# EAGLE schematic converter (EAGLE 7.3.2)
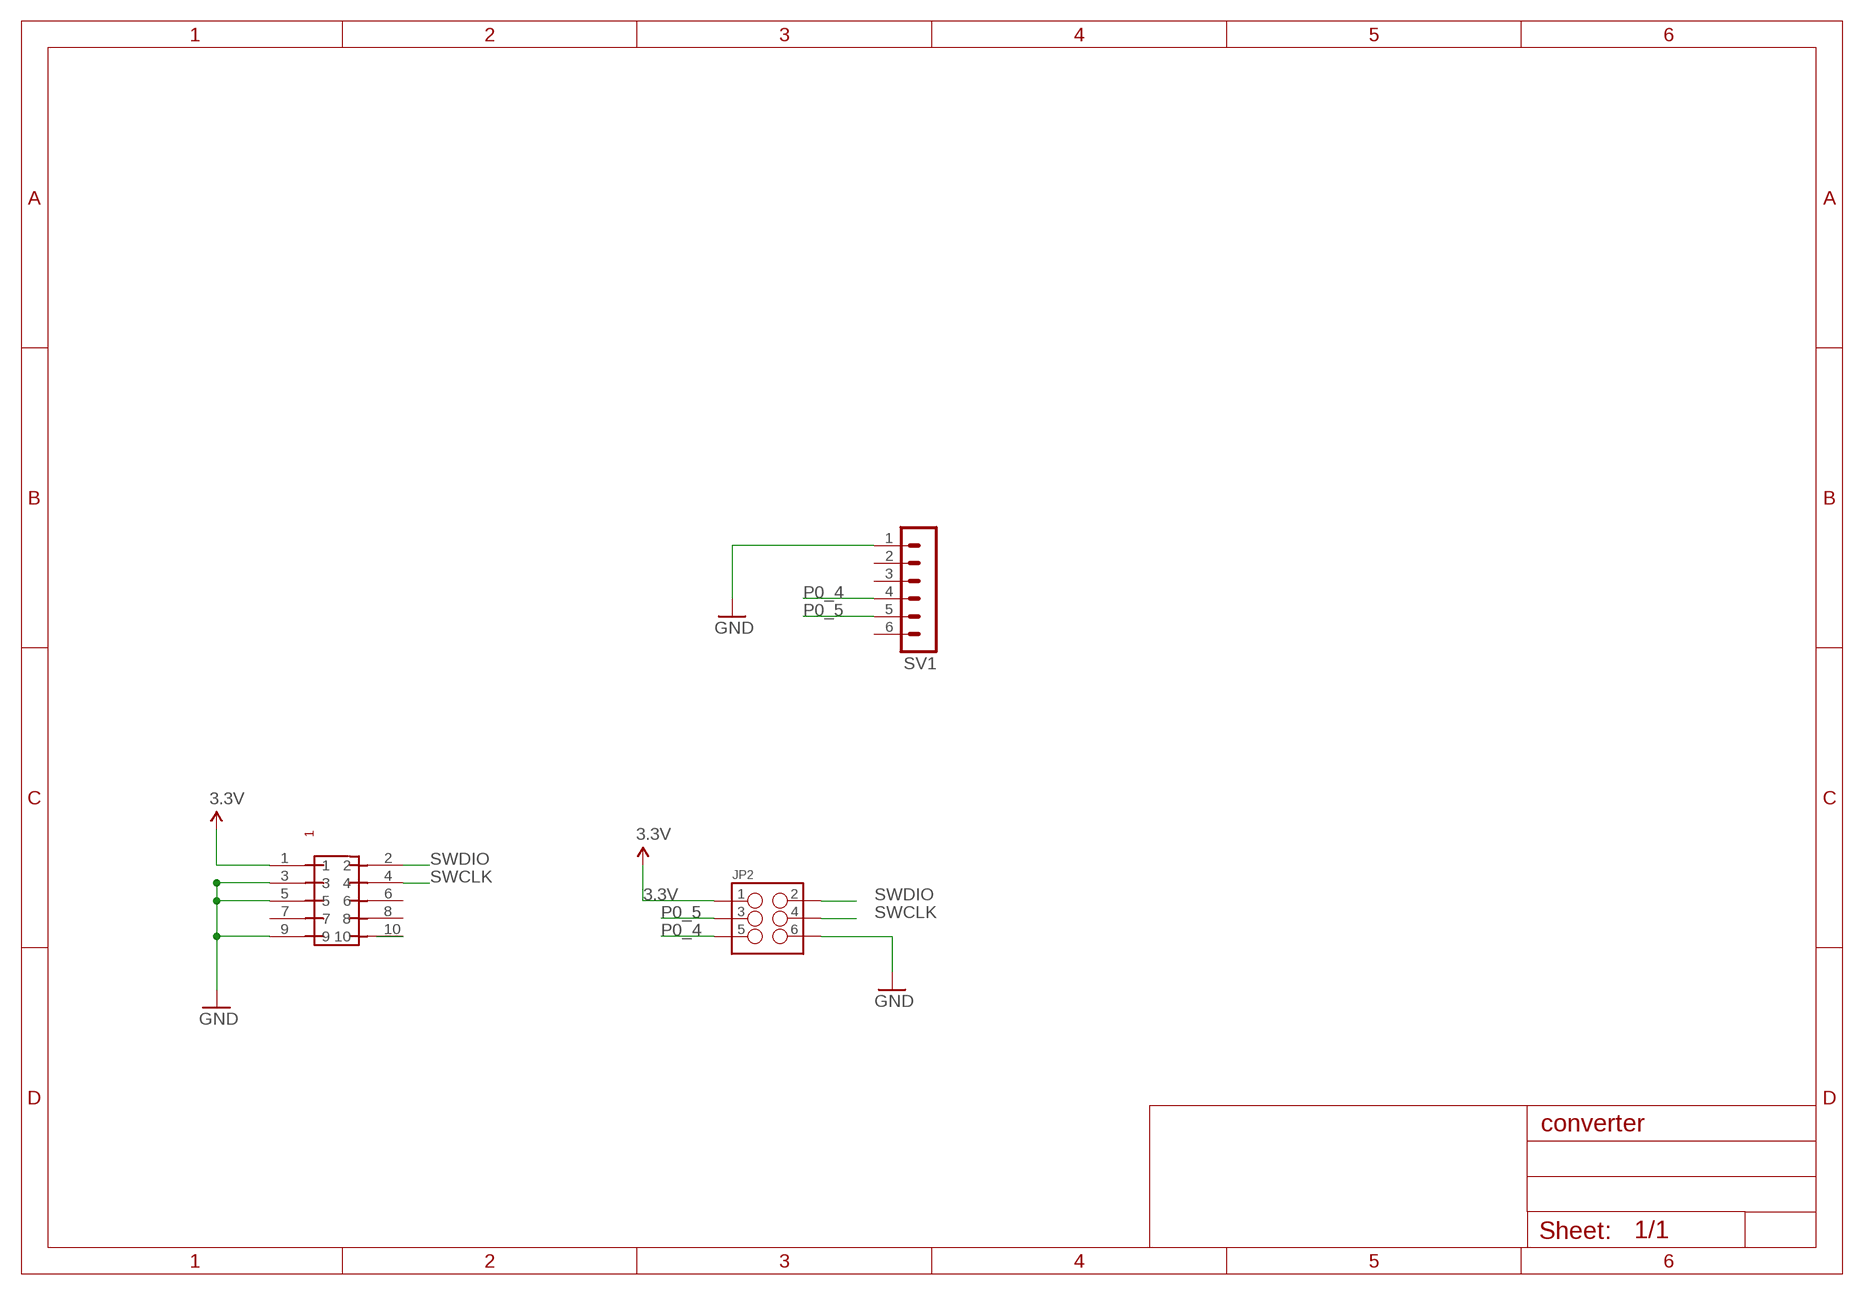
[diagram p0: schematic, sheet 1]

## Parts
JP2  M03X2  [2X3-SHROUDED]
SV1  MA06-1  [MA06-1]
U$5  PIN-HEADER-SMT(1.27MM)2X5  [PIN-HEADER-SMT(1.27MM)2X5]

## Nets
3.3V: JP2.1 U$5.1
GND: JP2.6 SV1.1 U$5.3 U$5.5 U$5.9
P0_4: JP2.5 SV1.4
P0_5: JP2.3 SV1.5
RESET: U$5.10
SWCLK: JP2.4 U$5.4
SWDIO: JP2.2 U$5.2
Unconnected: SV1.2 SV1.3 SV1.6 U$5.6 U$5.7 U$5.8

## Library data of the parts
JP2 = SparkFun-Connectors:M03X2: 2x3 .1" header. Shrouded, with keying- CONN-10681 SMT- CONN-11415 Pogo pins- HW-11044; PROD_ID: CONN-10681
SV1 = con-lstb:MA06-1: PIN HEADER; OC_FARNELL: unknown; OC_NEWARK: unknown
U$5 = GClue:PIN-HEADER-SMT(1.27MM)2X5: PIN-HEADER-SMT (1.27MM) 2x5